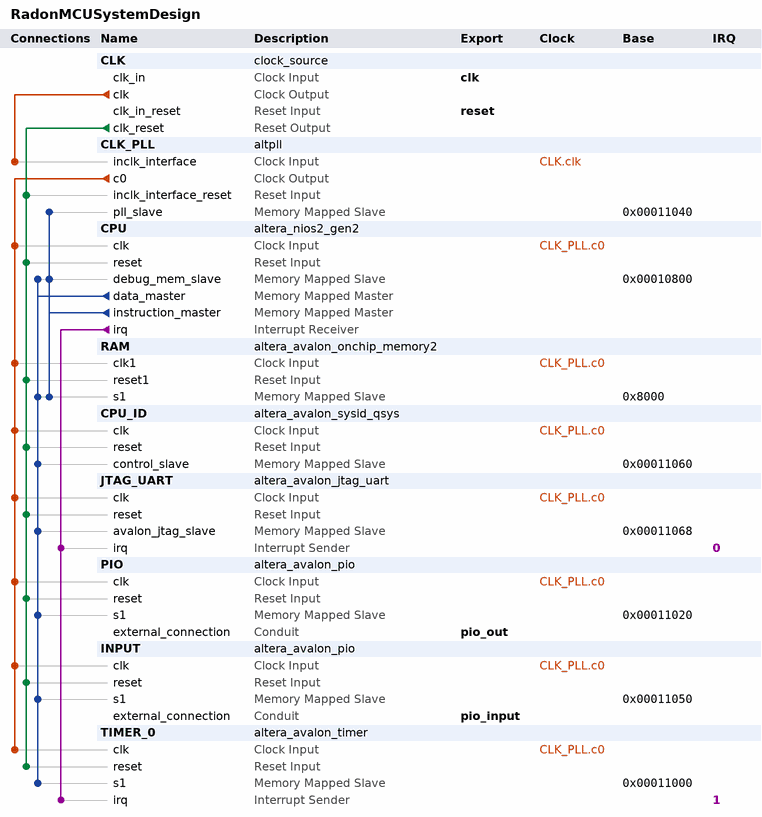
[diagram p0: system contents]
# Platform Designer (Qsys) system RadonMCUSystemDesign, MAX 10 10M08DAF256C8G
# Parameters at their usual value, and those the tool derives, are not listed.
package require -exact qsys 18.1
create_system RadonMCUSystemDesign
set_project_property DEVICE_FAMILY {MAX 10}
set_project_property DEVICE 10M08DAF256C8G

add_instance CLK clock_source 18.1
set_instance_parameter_value CLK clockFrequency 50000000

add_instance CLK_PLL altpll 18.1
set_instance_parameter_value CLK_PLL CLK0_DIVIDE_BY 1
set_instance_parameter_value CLK_PLL CLK0_MULTIPLY_BY 5
set_instance_parameter_value CLK_PLL INCLK0_INPUT_FREQUENCY 100000
set_instance_parameter_value CLK_PLL PORT_ARESET PORT_UNUSED
set_instance_parameter_value CLK_PLL PORT_LOCKED PORT_UNUSED
set_instance_parameter_value CLK_PLL PORT_clk1 PORT_UNUSED
set_instance_parameter_value CLK_PLL PORT_clk2 PORT_UNUSED
set_instance_parameter_value CLK_PLL PORT_clk3 PORT_UNUSED

add_instance CPU altera_nios2_gen2 18.1
set_instance_parameter_value CPU dcache_size 2048
set_instance_parameter_value CPU exceptionSlave RAM.s1
set_instance_parameter_value CPU icache_size 4096
set_instance_parameter_value CPU impl Tiny
set_instance_parameter_value CPU resetSlave RAM.s1

add_instance RAM altera_avalon_onchip_memory2 18.1
set_instance_parameter_value RAM dataWidth 32
set_instance_parameter_value RAM dualPort false
set_instance_parameter_value RAM initMemContent false
set_instance_parameter_value RAM initializationFileName onchip_mem.hex
set_instance_parameter_value RAM memorySize 32768

add_instance CPU_ID altera_avalon_sysid_qsys 18.1
set_instance_parameter_value CPU_ID id 1879048192

add_instance JTAG_UART altera_avalon_jtag_uart 18.1
set_instance_parameter_value JTAG_UART simInteractiveOptions NO_INTERACTIVE_WINDOWS

add_instance PIO altera_avalon_pio 18.1
set_instance_parameter_value PIO bitModifyingOutReg true
set_instance_parameter_value PIO direction Output
set_instance_parameter_value PIO resetValue 10
set_instance_parameter_value PIO width 4

add_instance INPUT altera_avalon_pio 18.1
set_instance_parameter_value INPUT direction Input
set_instance_parameter_value INPUT width 3

add_instance TIMER_0 altera_avalon_timer 18.1
set_instance_parameter_value TIMER_0 period 1
set_instance_parameter_value TIMER_0 periodUnits USEC

# connections
add_connection CLK.clk CLK_PLL.inclk_interface clock
add_connection CLK_PLL.c0 CPU.clk clock
add_connection CLK_PLL.c0 CPU_ID.clk clock
add_connection CLK_PLL.c0 INPUT.clk clock
add_connection CLK_PLL.c0 JTAG_UART.clk clock
add_connection CLK_PLL.c0 PIO.clk clock
add_connection CLK_PLL.c0 RAM.clk1 clock
add_connection CLK_PLL.c0 TIMER_0.clk clock
add_connection CLK.clk_reset CLK_PLL.inclk_interface_reset reset
add_connection CLK.clk_reset CPU.reset reset
add_connection CLK.clk_reset CPU_ID.reset reset
add_connection CLK.clk_reset INPUT.reset reset
add_connection CLK.clk_reset JTAG_UART.reset reset
add_connection CLK.clk_reset PIO.reset reset
add_connection CLK.clk_reset RAM.reset1 reset
add_connection CLK.clk_reset TIMER_0.reset reset
add_connection CPU.data_master CPU.debug_mem_slave avalon
set_connection_parameter_value CPU.data_master/CPU.debug_mem_slave baseAddress 0x00010800
add_connection CPU.data_master CPU_ID.control_slave avalon
set_connection_parameter_value CPU.data_master/CPU_ID.control_slave baseAddress 0x00011060
add_connection CPU.data_master INPUT.s1 avalon
set_connection_parameter_value CPU.data_master/INPUT.s1 baseAddress 0x00011050
add_connection CPU.data_master JTAG_UART.avalon_jtag_slave avalon
set_connection_parameter_value CPU.data_master/JTAG_UART.avalon_jtag_slave baseAddress 0x00011068
add_connection CPU.data_master PIO.s1 avalon
set_connection_parameter_value CPU.data_master/PIO.s1 baseAddress 0x00011020
add_connection CPU.data_master RAM.s1 avalon
set_connection_parameter_value CPU.data_master/RAM.s1 baseAddress 0x8000
add_connection CPU.data_master TIMER_0.s1 avalon
set_connection_parameter_value CPU.data_master/TIMER_0.s1 baseAddress 0x00011000
add_connection CPU.instruction_master CLK_PLL.pll_slave avalon
set_connection_parameter_value CPU.instruction_master/CLK_PLL.pll_slave baseAddress 0x00011040
add_connection CPU.instruction_master CPU.debug_mem_slave avalon
set_connection_parameter_value CPU.instruction_master/CPU.debug_mem_slave baseAddress 0x00010800
add_connection CPU.instruction_master RAM.s1 avalon
set_connection_parameter_value CPU.instruction_master/RAM.s1 baseAddress 0x8000
add_connection CPU.irq JTAG_UART.irq interrupt
set_connection_parameter_value CPU.irq/JTAG_UART.irq irqNumber 0
add_connection CPU.irq TIMER_0.irq interrupt
set_connection_parameter_value CPU.irq/TIMER_0.irq irqNumber 1

# exported interfaces
add_interface clk clock sink
set_interface_property clk EXPORT_OF CLK.clk_in
add_interface pio_input conduit end
set_interface_property pio_input EXPORT_OF INPUT.external_connection
add_interface pio_out conduit end
set_interface_property pio_out EXPORT_OF PIO.external_connection
add_interface reset reset sink
set_interface_property reset EXPORT_OF CLK.clk_in_reset

set_interconnect_requirement {$system} qsys_mm.clockCrossingAdapter HANDSHAKE
set_interconnect_requirement {$system} qsys_mm.enableEccProtection FALSE
set_interconnect_requirement {$system} qsys_mm.insertDefaultSlave FALSE
set_interconnect_requirement {$system} qsys_mm.maxAdditionalLatency 1

save_system RadonMCUSystemDesign.qsys
